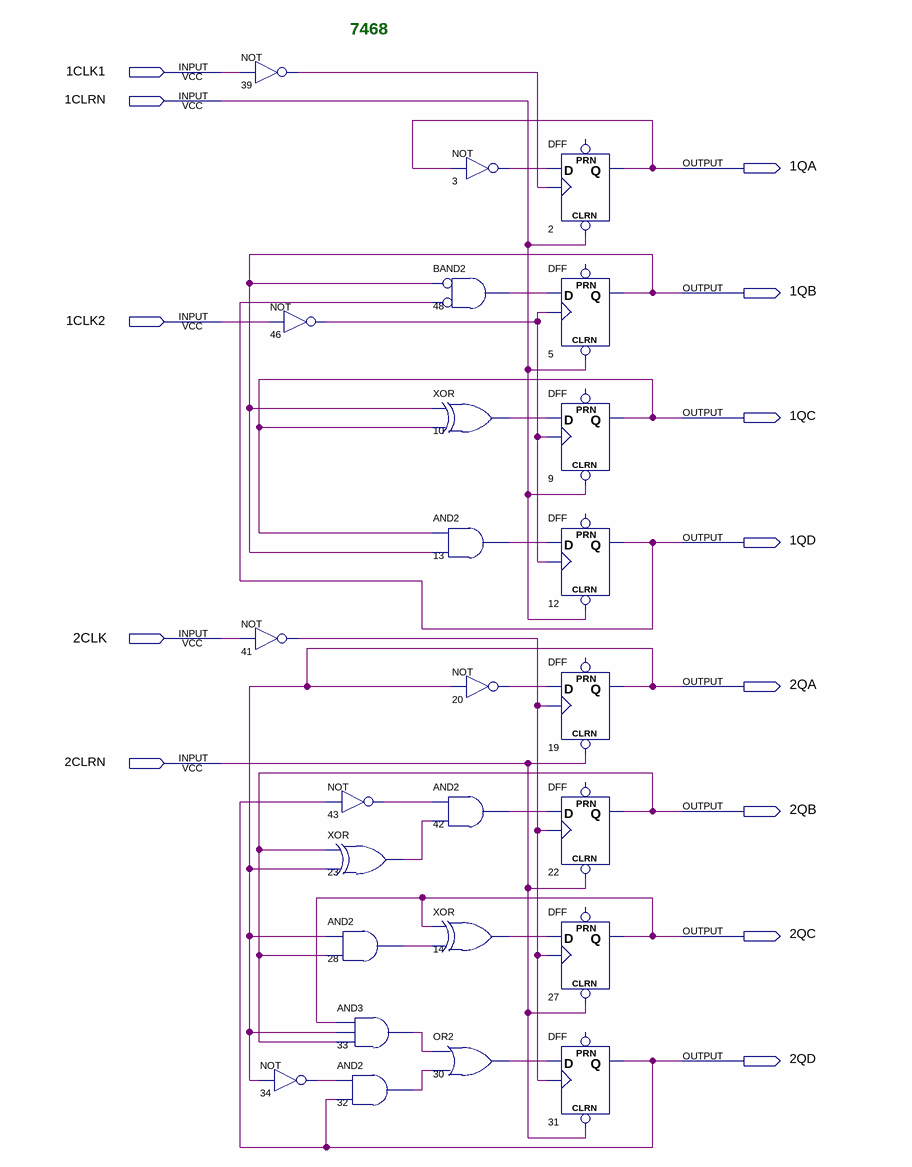
[diagram p0: schematic sheet]
// Quartus schematic 7468.bdf as structural Verilog: 25 symbols, 13 pins
module \7468  (
  input  \1CLK1 ,
  input  \1CLRN ,
  input  \1CLK2 ,
  input  \2CLK ,
  input  \2CLRN ,
  output \1QA ,
  output \1QB ,
  output \1QC ,
  output \1QD ,
  output \2QA ,
  output \2QB ,
  output \2QC ,
  output \2QD 
);

  wire n3_out, n10_out, n13_out, n14_out, n20_out, n23_out, n28_out, n30_out, n32_out, n33_out, n34_out,
       n39_out, n41_out, n42_out, n43_out, n46_out, n48_out;

  not u_39 (n39_out, \1CLK1 );
  not u_46 (n46_out, \1CLK2 );
  not u_41 (n41_out, \2CLK );
  not u_34 (n34_out, \2QA );
  not u_43 (n43_out, \2QD );
  xor u_23 (n23_out, \2QB , \2QA );
  and u_28 (n28_out, \2QA , \2QB );
  and u_33 (n33_out, \2QC , \2QA , \2QB );
  and u_32 (n32_out, n34_out, \2QD );
  not u_3 (n3_out, \1QA );
  and u_48 (n48_out, ~\1QB , ~\1QD );  // BAND2
  xor u_10 (n10_out, \1QB , \1QC );
  and u_13 (n13_out, \1QC , \1QB );
  not u_20 (n20_out, \2QA );
  and u_42 (n42_out, n43_out, n23_out);
  xor u_14 (n14_out, \2QC , n28_out);
  or u_30 (n30_out, n33_out, n32_out);
  DFF u_2 (.CLRN(\1CLRN ), .CLK(n39_out), .D(n3_out), .Q(\1QA ));  // open: PRN
  DFF u_5 (.CLRN(\1CLRN ), .CLK(n46_out), .D(n48_out), .Q(\1QB ));  // open: PRN
  DFF u_9 (.CLRN(\1CLRN ), .CLK(n46_out), .D(n10_out), .Q(\1QC ));  // open: PRN
  DFF u_12 (.CLRN(\1CLRN ), .CLK(n46_out), .D(n13_out), .Q(\1QD ));  // open: PRN
  DFF u_19 (.CLRN(\2CLRN ), .CLK(n41_out), .D(n20_out), .Q(\2QA ));  // open: PRN
  DFF u_22 (.CLRN(\2CLRN ), .CLK(n41_out), .D(n42_out), .Q(\2QB ));  // open: PRN
  DFF u_27 (.CLRN(\2CLRN ), .CLK(n41_out), .D(n14_out), .Q(\2QC ));  // open: PRN
  DFF u_31 (.CLRN(\2CLRN ), .CLK(n41_out), .D(n30_out), .Q(\2QD ));  // open: PRN

  // Notes on the sheet:
  //   7468
endmodule
